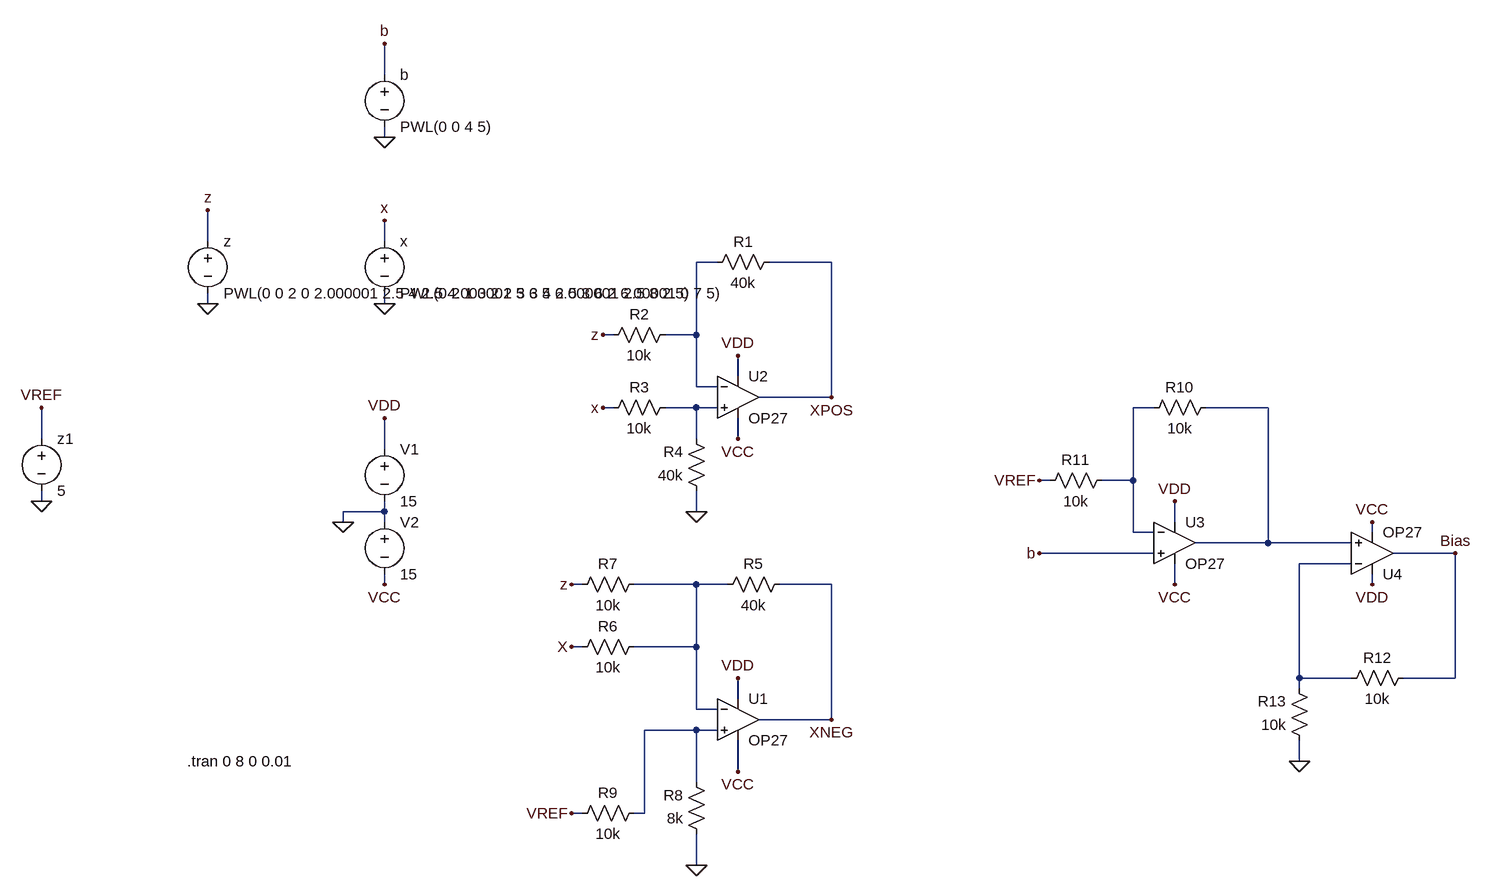
[diagram p0: schematic OPAMPDriveSimulation.asc]
OPAMPDriveSimulation.asc, the LTspice schematic file:
Version 4
SHEET 1 1348 680
WIRE -464 -592 -464 -640
WIRE -464 -496 -464 -512
WIRE -736 -336 -736 -384
WIRE -464 -336 -464 -368
WIRE 48 -304 16 -304
WIRE 224 -304 128 -304
WIRE -736 -240 -736 -256
WIRE -464 -240 -464 -256
WIRE -112 -192 -128 -192
WIRE 16 -192 16 -304
WIRE 16 -192 -32 -192
WIRE 80 -128 80 -160
WIRE 16 -112 16 -192
WIRE 48 -112 16 -112
WIRE 224 -96 224 -304
WIRE 224 -96 112 -96
WIRE -112 -80 -128 -80
WIRE 16 -80 -32 -80
WIRE 48 -80 16 -80
WIRE 720 -80 688 -80
WIRE 896 -80 800 -80
WIRE -992 -32 -992 -80
WIRE 16 -32 16 -80
WIRE 80 -32 80 -64
WIRE -464 -16 -464 -64
WIRE 560 32 544 32
WIRE 688 32 688 -80
WIRE 688 32 640 32
WIRE -992 64 -992 48
WIRE -464 80 -464 64
WIRE -464 80 -528 80
WIRE 16 80 16 48
WIRE -528 96 -528 80
WIRE -464 96 -464 80
WIRE 752 96 752 64
WIRE 688 112 688 32
WIRE 720 112 688 112
WIRE 1056 112 1056 96
WIRE 896 128 896 -80
WIRE 896 128 784 128
WIRE 1024 128 896 128
WIRE 720 144 544 144
WIRE 1184 144 1088 144
WIRE 1024 160 944 160
WIRE -464 192 -464 176
WIRE -160 192 -176 192
WIRE 16 192 -80 192
WIRE 64 192 16 192
WIRE 224 192 144 192
WIRE 752 192 752 160
WIRE 1056 192 1056 176
WIRE -160 288 -176 288
WIRE 16 288 16 192
WIRE 16 288 -80 288
WIRE 944 336 944 160
WIRE 1024 336 944 336
WIRE 1184 336 1184 144
WIRE 1184 336 1104 336
WIRE 944 352 944 336
WIRE 80 368 80 336
WIRE 16 384 16 288
WIRE 48 384 16 384
WIRE 224 400 224 192
WIRE 224 400 112 400
WIRE 16 416 -64 416
WIRE 48 416 16 416
WIRE 944 464 944 432
WIRE 80 480 80 432
WIRE 16 496 16 416
WIRE -160 544 -176 544
WIRE -64 544 -64 416
WIRE -64 544 -80 544
WIRE 16 624 16 576
FLAG -464 -64 VDD
FLAG -528 96 0
FLAG -464 192 VCC
FLAG 80 -160 VDD
FLAG 80 336 VDD
FLAG 80 -32 VCC
FLAG 80 480 VCC
FLAG 16 80 0
FLAG -128 -80 x
FLAG -128 -192 z
FLAG -464 -368 x
FLAG -736 -384 z
FLAG -464 -240 0
FLAG -736 -240 0
FLAG -992 -80 VREF
FLAG -992 64 0
FLAG 16 624 0
FLAG -176 192 z
FLAG -176 288 X
FLAG -176 544 VREF
FLAG 224 -96 XPOS
FLAG 224 400 XNEG
FLAG 752 64 VDD
FLAG 752 192 VCC
FLAG 544 144 b
FLAG 544 32 VREF
FLAG -464 -640 b
FLAG -464 -496 0
FLAG 1056 192 VDD
FLAG 1056 96 VCC
FLAG 944 464 0
FLAG 1184 144 Bias
SYMBOL Opamps\\OP27 80 336 R0
SYMATTR InstName U1
SYMBOL Opamps\\OP27 80 -160 R0
SYMATTR InstName U2
SYMBOL voltage -464 -32 R0
WINDOW 123 0 0 Left 2
WINDOW 39 0 0 Left 2
SYMATTR InstName V1
SYMATTR Value 15
SYMBOL voltage -464 80 R0
WINDOW 123 0 0 Left 2
WINDOW 39 0 0 Left 2
SYMATTR InstName V2
SYMATTR Value 15
SYMBOL voltage -464 -352 R0
WINDOW 123 0 0 Left 2
WINDOW 39 0 0 Left 2
SYMATTR InstName x
SYMATTR Value PWL(0 2 1 3 2 2 3 3 4 2 5 3 6 2 6.00001 0 7 5)
SYMBOL voltage -736 -352 R0
WINDOW 123 0 0 Left 2
WINDOW 39 0 0 Left 2
SYMATTR InstName z
SYMATTR Value PWL(0 0 2 0 2.000001 2.5 4 2.5 4.000001 5 6 5 6.000001 2.5 8 2.5)
SYMBOL res 144 -320 R90
WINDOW 0 0 56 VBottom 2
WINDOW 3 32 56 VTop 2
SYMATTR InstName R1
SYMATTR Value 40k
SYMBOL res -16 -208 R90
WINDOW 0 0 56 VBottom 2
WINDOW 3 32 56 VTop 2
SYMATTR InstName R2
SYMATTR Value 10k
SYMBOL res -16 -96 R90
WINDOW 0 0 56 VBottom 2
WINDOW 3 32 56 VTop 2
SYMATTR InstName R3
SYMATTR Value 10k
SYMBOL res 32 64 R180
WINDOW 0 36 76 Left 2
WINDOW 3 36 40 Left 2
SYMATTR InstName R4
SYMATTR Value 40k
SYMBOL res 160 176 R90
WINDOW 0 0 56 VBottom 2
WINDOW 3 32 56 VTop 2
SYMATTR InstName R5
SYMATTR Value 40k
SYMBOL res -64 272 R90
WINDOW 0 0 56 VBottom 2
WINDOW 3 32 56 VTop 2
SYMATTR InstName R6
SYMATTR Value 10k
SYMBOL res -64 176 R90
WINDOW 0 0 56 VBottom 2
WINDOW 3 32 56 VTop 2
SYMATTR InstName R7
SYMATTR Value 10k
SYMBOL res 32 592 R180
WINDOW 0 36 76 Left 2
WINDOW 3 36 40 Left 2
SYMATTR InstName R8
SYMATTR Value 8k
SYMBOL voltage -992 -48 R0
WINDOW 123 0 0 Left 2
WINDOW 39 0 0 Left 2
SYMATTR InstName z1
SYMATTR Value 5
SYMBOL res -64 528 R90
WINDOW 0 0 56 VBottom 2
WINDOW 3 32 56 VTop 2
SYMATTR InstName R9
SYMATTR Value 10k
SYMBOL Opamps\\OP27 752 64 R0
SYMATTR InstName U3
SYMBOL res 816 -96 R90
WINDOW 0 0 56 VBottom 2
WINDOW 3 32 56 VTop 2
SYMATTR InstName R10
SYMATTR Value 10k
SYMBOL res 656 16 R90
WINDOW 0 0 56 VBottom 2
WINDOW 3 32 56 VTop 2
SYMATTR InstName R11
SYMATTR Value 10k
SYMBOL voltage -464 -608 R0
WINDOW 123 0 0 Left 2
WINDOW 39 0 0 Left 2
SYMATTR InstName b
SYMATTR Value PWL(0 0 4 5)
SYMBOL Opamps\\OP27 1056 208 M180
SYMATTR InstName U4
SYMBOL res 1008 352 R270
WINDOW 0 32 56 VTop 2
WINDOW 3 0 56 VBottom 2
SYMATTR InstName R12
SYMATTR Value 10k
SYMBOL res 960 448 R180
WINDOW 0 36 76 Left 2
WINDOW 3 36 40 Left 2
SYMATTR InstName R13
SYMATTR Value 10k
TEXT -768 464 Left 2 !.tran 0 8 0 0.01

The netlist it stands for:
* OPAMPDriveSimulation.asc
XU1 N007 N006 VDD VCC XNEG OP27  ; pins In+ In- V+ V- OUT
XU2 N002 N001 VDD VCC XPOS OP27  ; pins In+ In- V+ V- OUT
V1 VDD 0 15
V2 0 VCC 15
V§x x 0 PWL(0 2 1 3 2 2 3 3 4 2 5 3 6 2 6.00001 0 7 5)
V§z z 0 PWL(0 0 2 0 2.000001 2.5 4 2.5 4.000001 5 6 5 6.000001 2.5 8 2.5)
R1 XPOS N001 40k
R2 N001 z 10k
R3 N002 x 10k
R4 0 N002 40k
R5 XNEG N006 40k
R6 N006 x 10k
R7 N006 z 10k
R8 0 N007 8k
V§z1 VREF 0 5
R9 N007 VREF 10k
XU3 b N003 VDD VCC N004 OP27  ; pins In+ In- V+ V- OUT
R10 N004 N003 10k
R11 N003 VREF 10k
V§b b 0 PWL(0 0 4 5)
XU4 N004 N005 VDD VCC Bias OP27  ; pins In+ In- V+ V- OUT
R12 N005 Bias 10k
R13 0 N005 10k
.tran 0 8 0 0.01
.lib ADI.lib
.backanno
.end